# Altium project Board1.PrjPcb
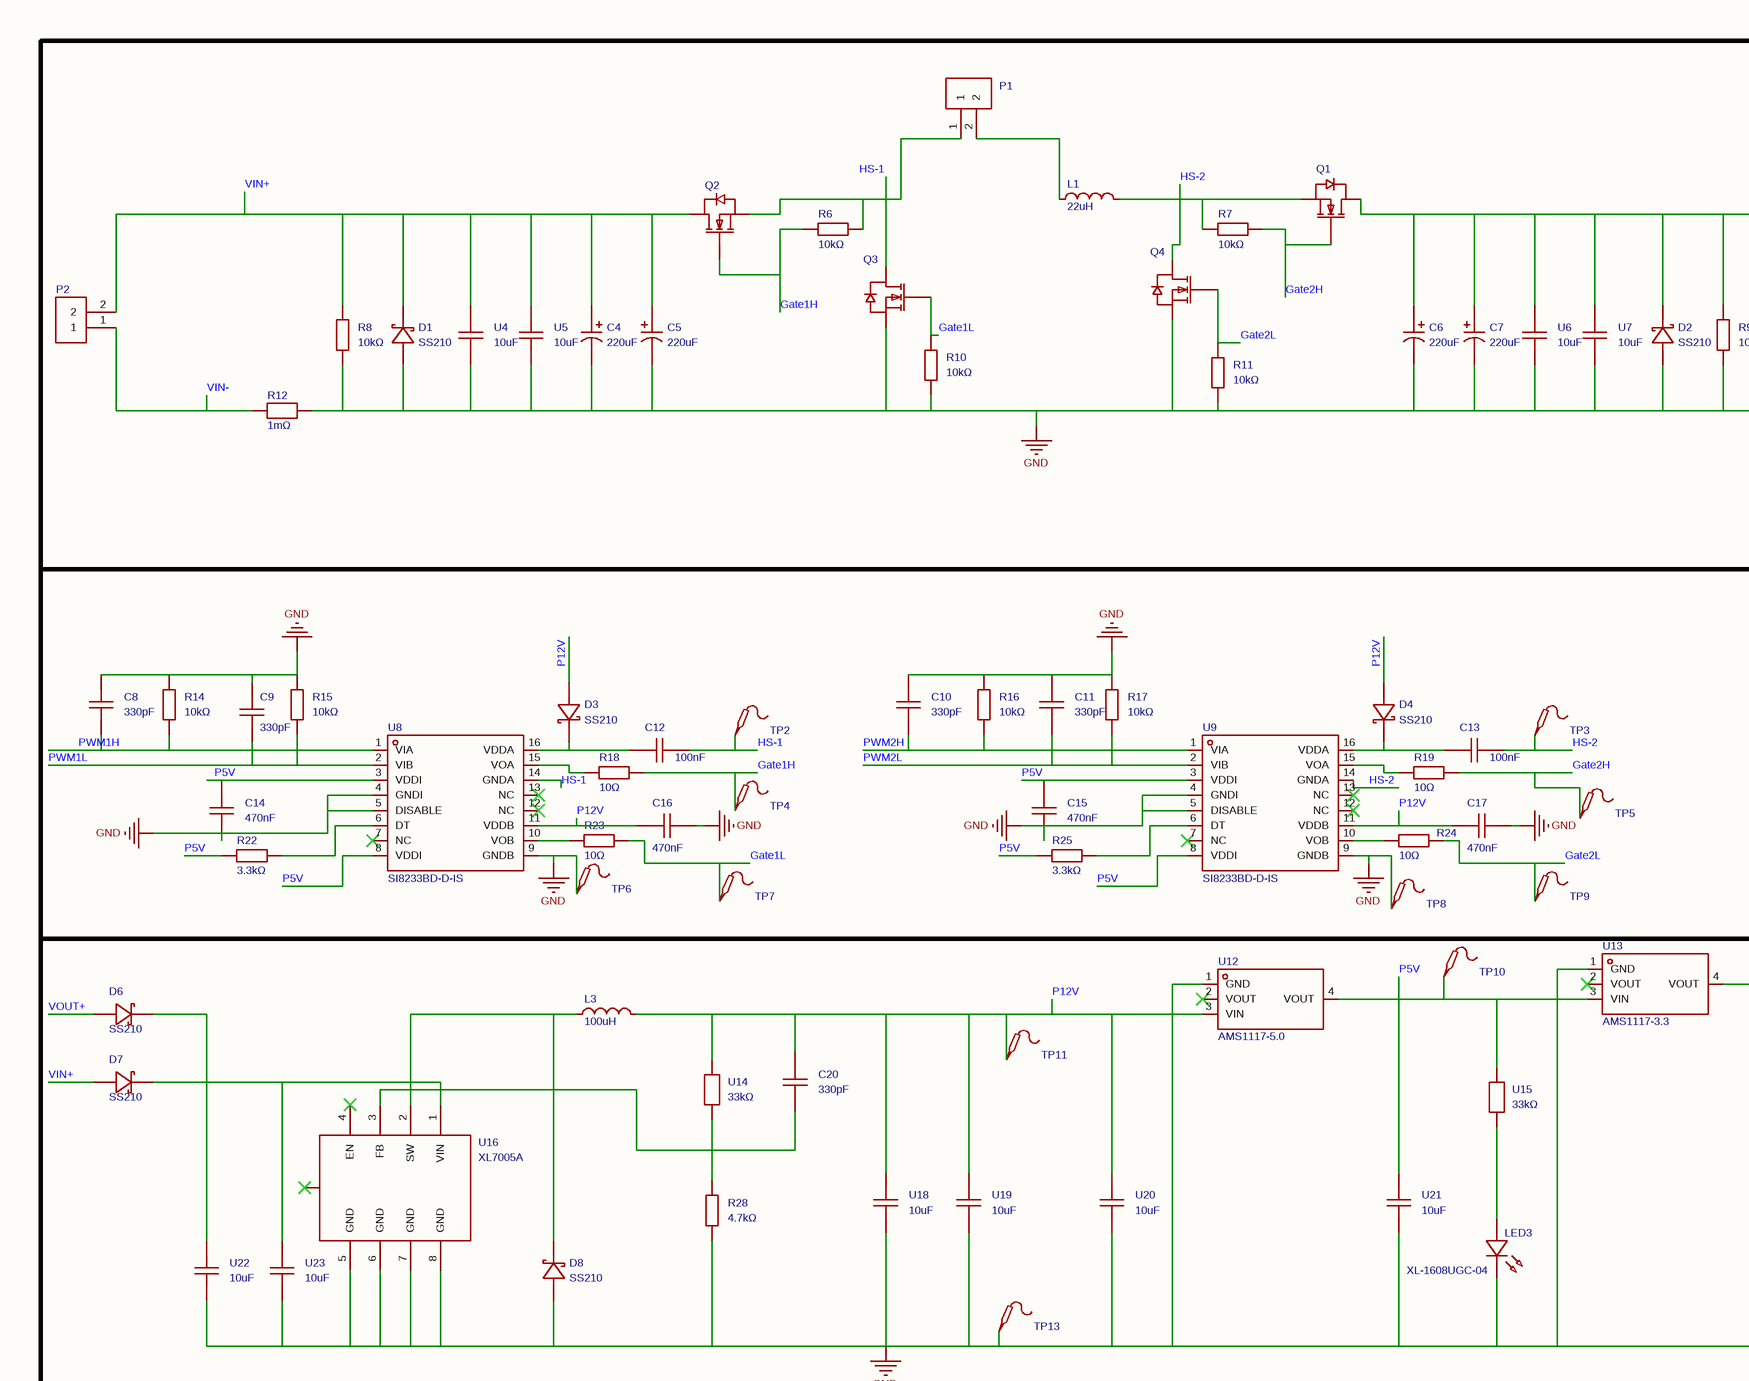
[diagram p0: P1.schdoc, top left]
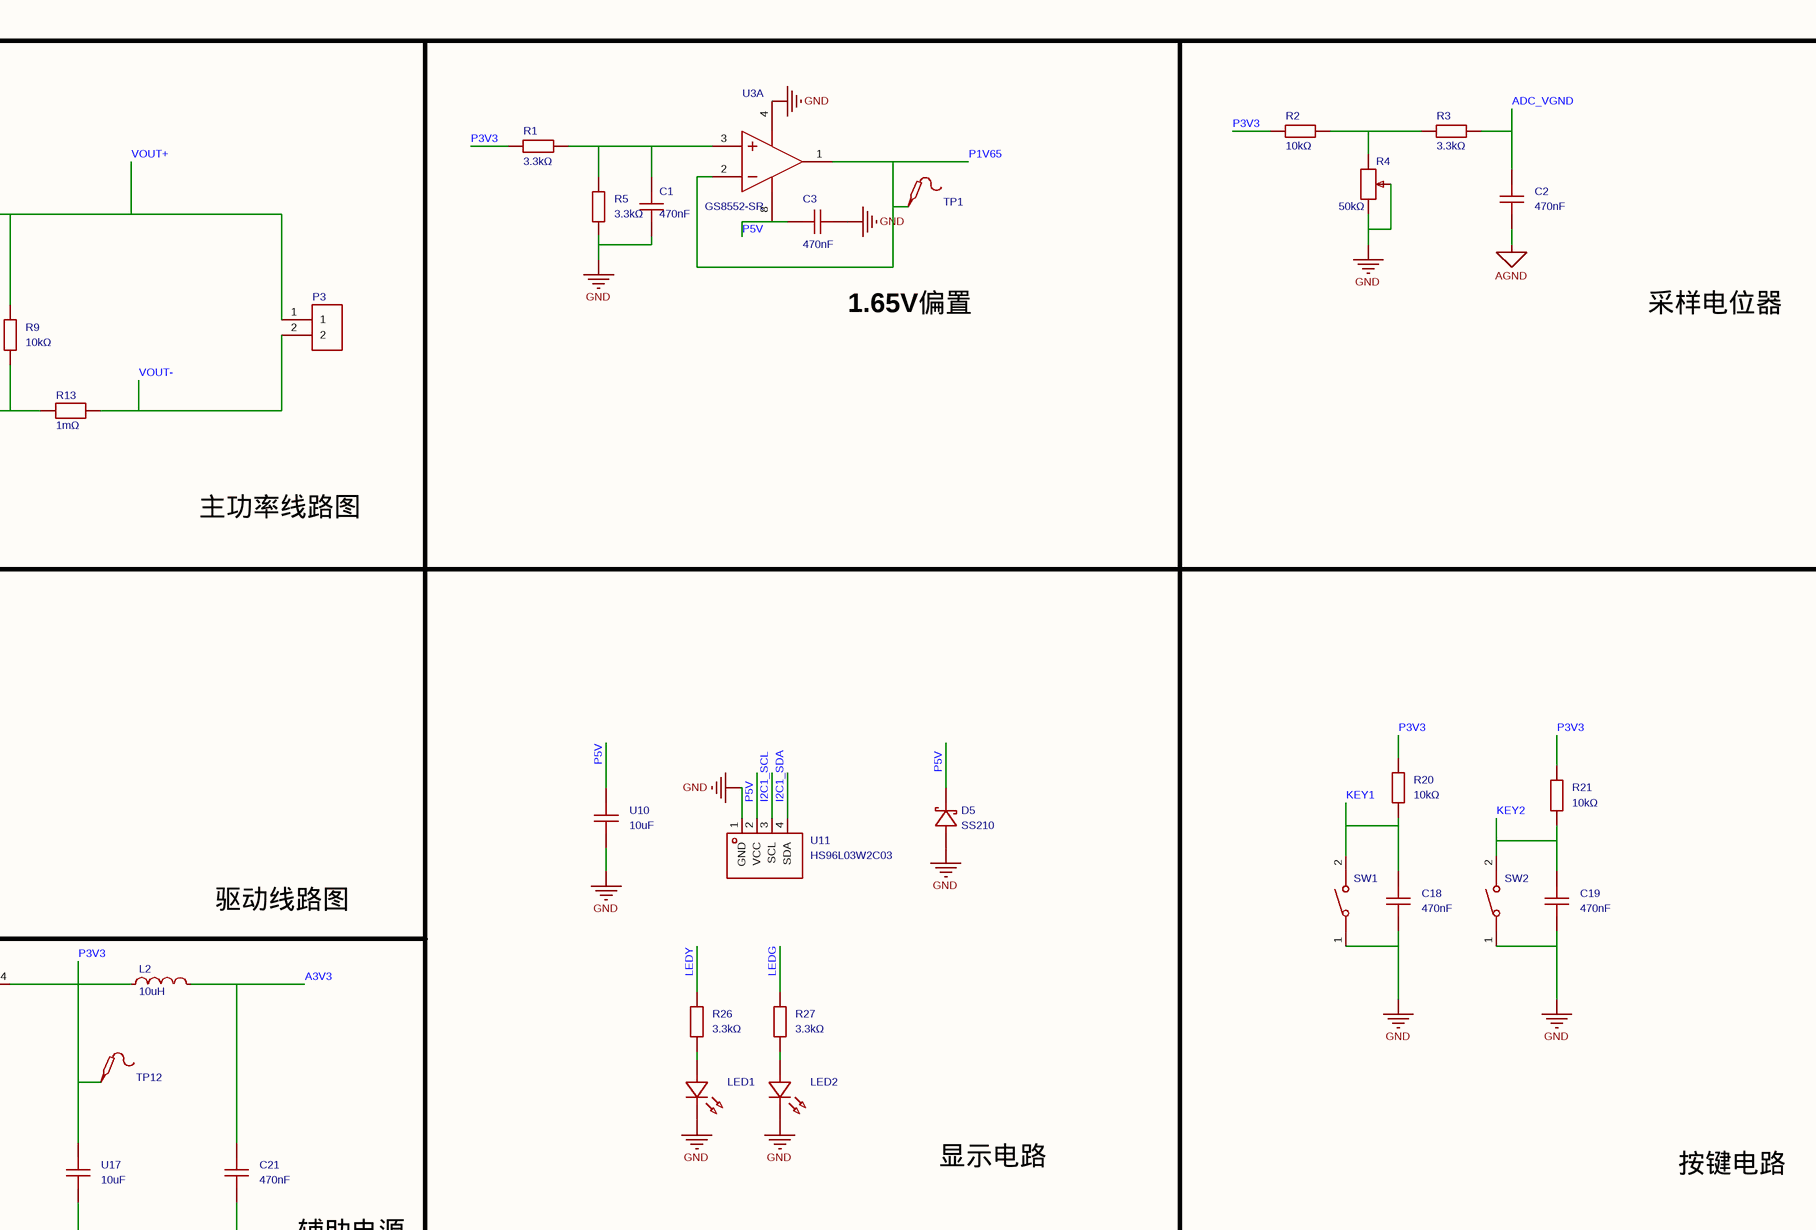
[diagram p1: P1.schdoc, top right]
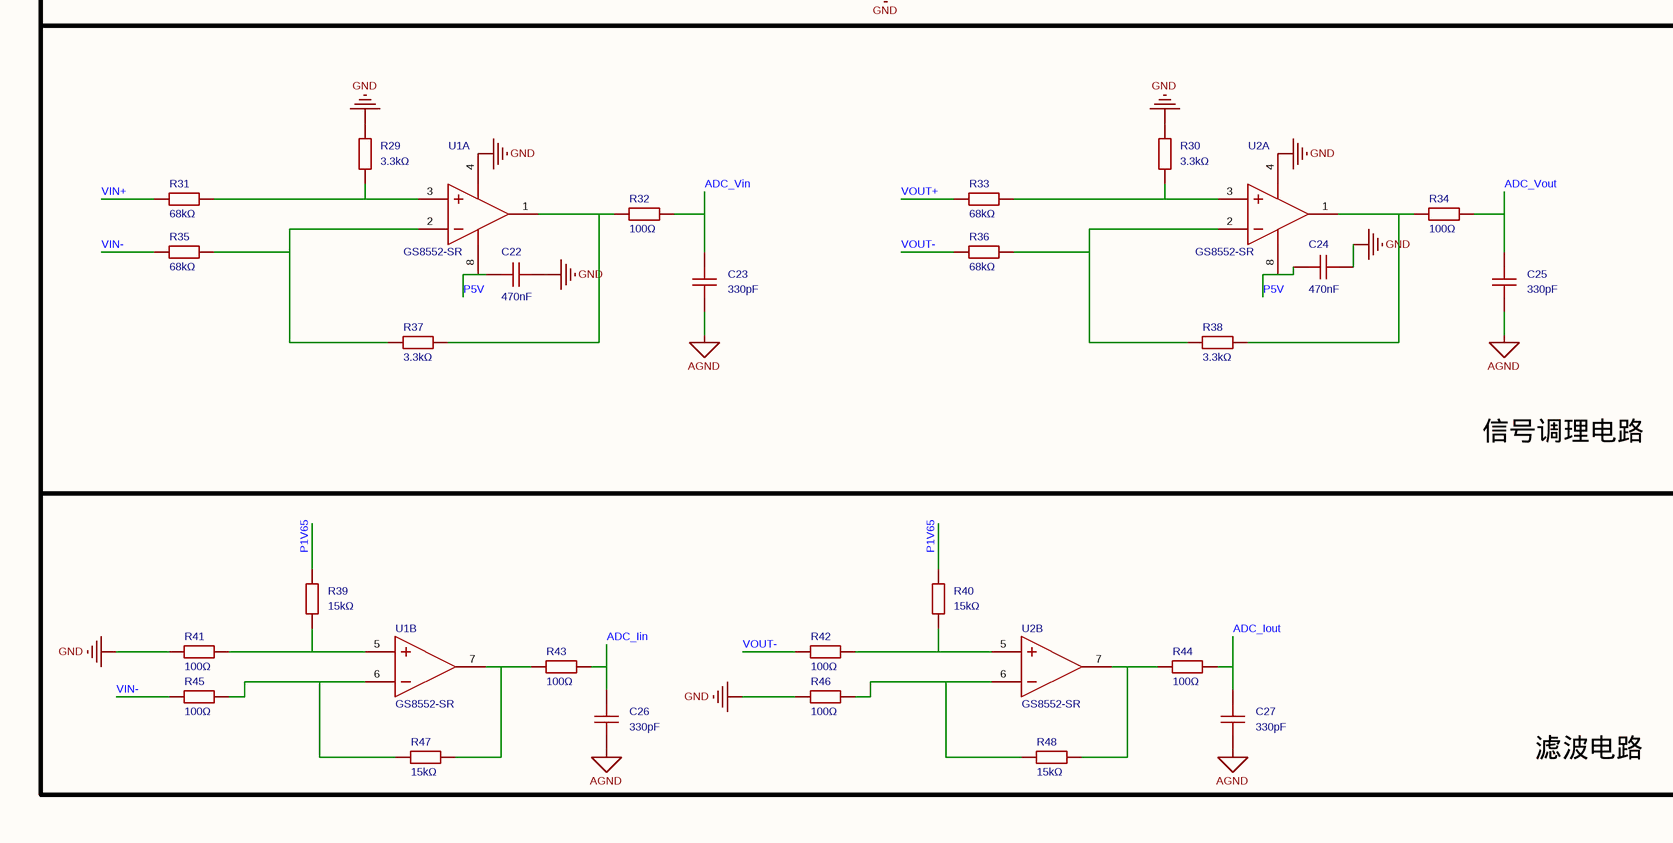
[diagram p2: P1.schdoc, bottom left]
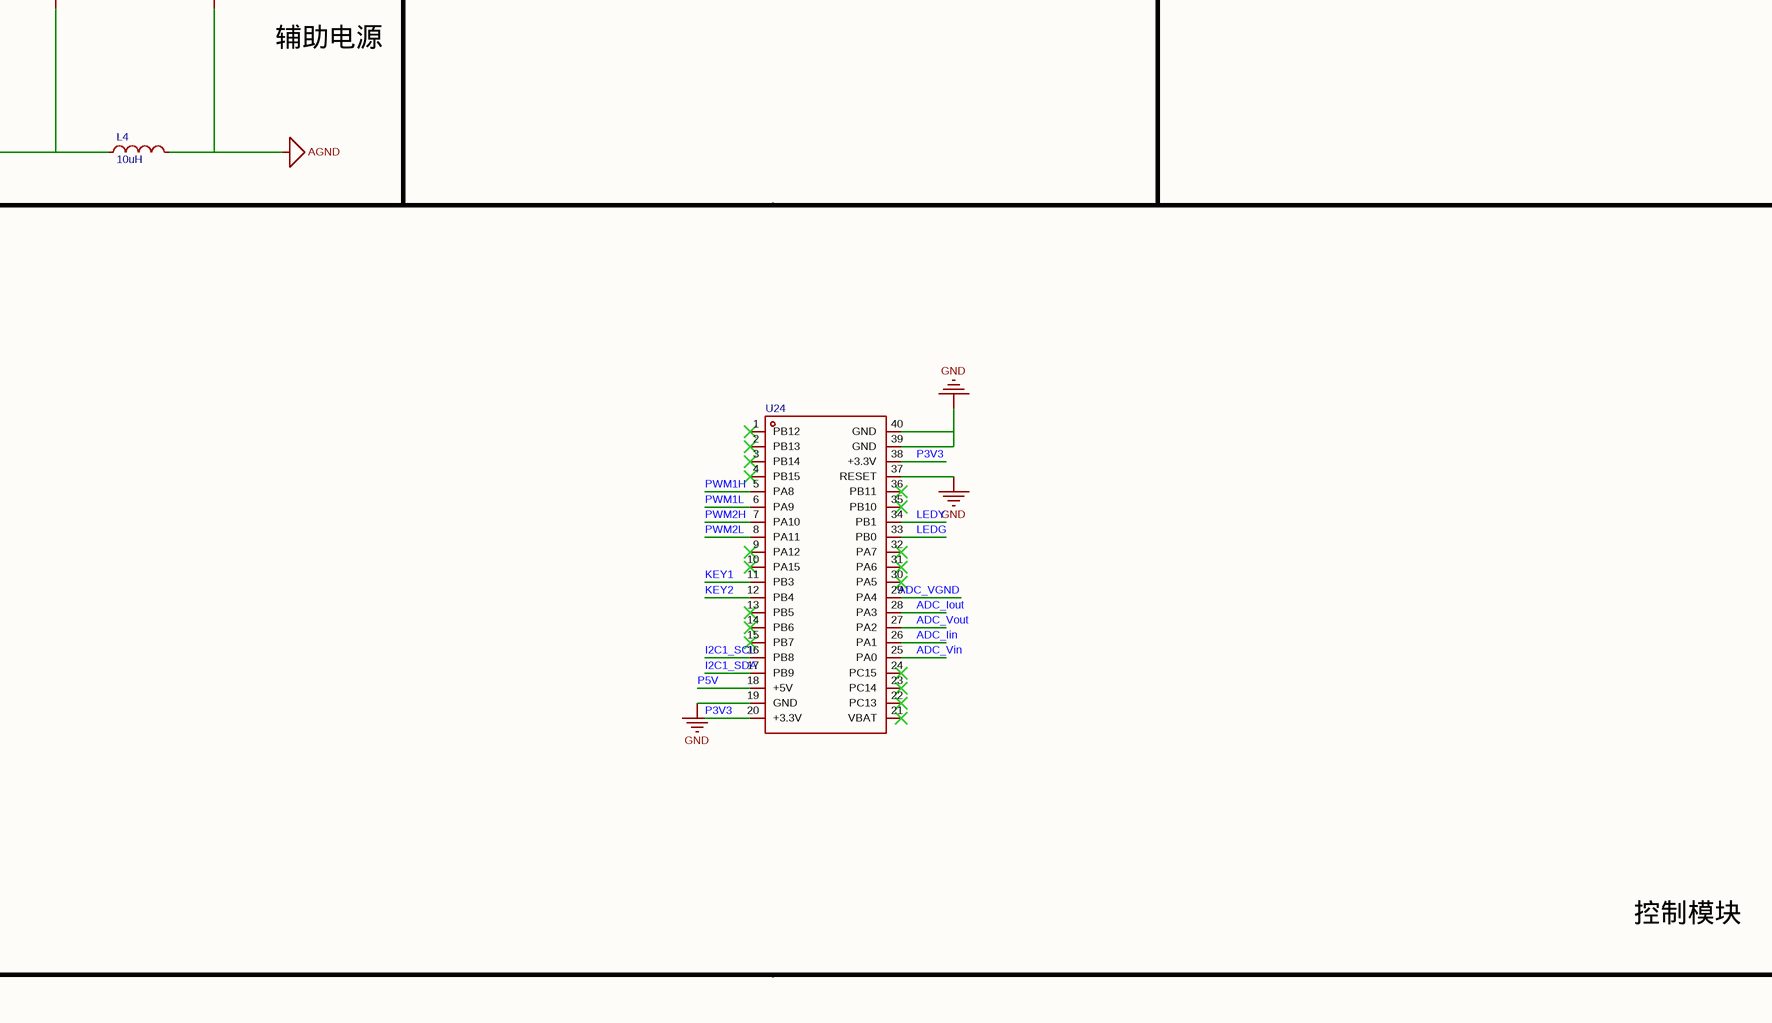
[diagram p3: P1.schdoc, bottom right]
1 sheet, 136 parts. Net scope: global (net labels, ports and power ports of the same name join across sheets).
Board file: PCB1.pcbdoc

## Sheet P1.schdoc
size 594 x 419 mm; Symbol: Sheet-Symbol_A4; Company: 嘉立创EDA; Version: V1.0; Page Size: A4; @Project Name: fin; @Page Count: 1; @Update Date: 2026-05-17; @Create Date: 2026-05-17; @Schematic Name: Schematic1; @Page No: 1; @Page Name: P1; Device: Sheet-Symbol_A4; Border: 1; Title Block Position: 3; Width: 2338; Height: 1652; Region Start: 1; X Region Count: 6; Y Region Count: 4; Blade Width: 10; @Board Name: Board1; @Create Time: 12:38:21; @Update Time: 12:38:21

### Parts
C1  470nF  [CAP-TH_L6.0-W5.0-P5.08-D0.5]
C2  470nF  [CAP-TH_L6.0-W5.0-P5.08-D0.5]
C3  470nF  [CAP-TH_L6.0-W5.0-P5.08-D0.5]
C4  220uF  [CAP-SMD_BD10.0-L10.3-W10.3-FD-LS11.0]
C5  220uF  [CAP-SMD_BD10.0-L10.3-W10.3-FD-LS11.0]
C6  220uF  [CAP-SMD_BD10.0-L10.3-W10.3-FD-LS11.0]
C7  220uF  [CAP-SMD_BD10.0-L10.3-W10.3-FD-LS11.0]
C8  330pF  [CAP-TH_L4.9-W3.7-P5.08-D0.5]
C9  330pF  [CAP-TH_L4.9-W3.7-P5.08-D0.5]
C10  330pF  [CAP-TH_L4.9-W3.7-P5.08-D0.5]
C11  330pF  [CAP-TH_L4.9-W3.7-P5.08-D0.5]
C12  100nF  [CAP-TH_L5.8-W3.6-P5.0-D0.6]
C13  100nF  [CAP-TH_L5.8-W3.6-P5.0-D0.6]
C14  470nF  [CAP-TH_L6.0-W5.0-P5.08-D0.5]
C15  470nF  [CAP-TH_L6.0-W5.0-P5.08-D0.5]
C16  470nF  [CAP-TH_L6.0-W5.0-P5.08-D0.5]
C17  470nF  [CAP-TH_L6.0-W5.0-P5.08-D0.5]
C18  470nF  [CAP-TH_L6.0-W5.0-P5.08-D0.5]
C19  470nF  [CAP-TH_L6.0-W5.0-P5.08-D0.5]
C20  330pF  [CAP-TH_L4.9-W3.7-P5.08-D0.5]
C21  470nF  [CAP-TH_L6.0-W5.0-P5.08-D0.5]
C22  470nF  [CAP-TH_L6.0-W5.0-P5.08-D0.5]
C23  330pF  [CAP-TH_L4.9-W3.7-P5.08-D0.5]
C24  470nF  [CAP-TH_L6.0-W5.0-P5.08-D0.5]
C25  330pF  [CAP-TH_L4.9-W3.7-P5.08-D0.5]
C26  330pF  [CAP-TH_L4.9-W3.7-P5.08-D0.5]
C27  330pF  [CAP-TH_L4.9-W3.7-P5.08-D0.5]
D1  SS210  [SMA_L4.3-W2.6-LS5.0-RD]
D2  SS210  [SMA_L4.3-W2.6-LS5.0-RD]
D3  SS210  [SMA_L4.3-W2.6-LS5.0-RD]
D4  SS210  [SMA_L4.3-W2.6-LS5.0-RD]
D5  SS210  [SMA_L4.3-W2.6-LS5.0-RD]
D6  SS210  [SMA_L4.3-W2.6-LS5.0-RD]
D7  SS210  [SMA_L4.3-W2.6-LS5.0-RD]
D8  SS210  [SMA_L4.3-W2.6-LS5.0-RD]
L1  22uH  [IND-SMD_2P-L16.9-W16.9]
L2  10uH  [L0603]
L3  100uH  [IND-SMD_L6.0-W6.0_CR6020]
L4  10uH  [L0603]
LED1  XL-1608UYC-06  [LED0603-RD-YELLOW]  (value not drawn)
LED2  XL-1608UGC-04  [LED0603-RD_GREEN]  (value not drawn)
LED3  XL-1608UGC-04  [LED0603-RD_GREEN]
P1  WJ500V-5.08-2P  [CONN-TH_2P-P5.00_WJ500V-5.08-2P]  (value not drawn)
P2  WJ500V-5.08-2P  [CONN-TH_2P-P5.00_WJ500V-5.08-2P]  (value not drawn)
P3  WJ500V-5.08-2P  [CONN-TH_2P-P5.00_WJ500V-5.08-2P]  (value not drawn)
Q1  IRFP4468PBF  [TO-247AC-3_L15.8-W5.0-P5.46-L]  (value not drawn)
Q2  IRFP4468PBF  [TO-247AC-3_L15.8-W5.0-P5.46-L]  (value not drawn)
Q3  IRFP4468PBF  [TO-247AC-3_L15.8-W5.0-P5.46-L]  (value not drawn)
Q4  IRFP4468PBF  [TO-247AC-3_L15.8-W5.0-P5.46-L]  (value not drawn)
R1  3.3kΩ  [RES-TH_BD2.2-L6.5-P10.50-D0.6]
R2  10kΩ  [RES-TH_BD4.5-L11.5-P15.50-D0.7]
R3  3.3kΩ  [RES-TH_BD2.2-L6.5-P10.50-D0.6]
R4  50kΩ  [RES-ADJ-TH_3296W]
R5  3.3kΩ  [RES-TH_BD2.2-L6.5-P10.50-D0.6]
R6  10kΩ  [RES-TH_BD4.5-L11.5-P15.50-D0.7]
R7  10kΩ  [RES-TH_BD4.5-L11.5-P15.50-D0.7]
R8  10kΩ  [RES-TH_BD4.5-L11.5-P15.50-D0.7]
R9  10kΩ  [RES-TH_BD4.5-L11.5-P15.50-D0.7]
R10  10kΩ  [RES-TH_BD4.5-L11.5-P15.50-D0.7]
R11  10kΩ  [RES-TH_BD4.5-L11.5-P15.50-D0.7]
R12  1mΩ  [R2512]
R13  1mΩ  [R2512]
R14  10kΩ  [RES-TH_BD4.5-L11.5-P15.50-D0.7]
R15  10kΩ  [RES-TH_BD4.5-L11.5-P15.50-D0.7]
R16  10kΩ  [RES-TH_BD4.5-L11.5-P15.50-D0.7]
R17  10kΩ  [RES-TH_BD4.5-L11.5-P15.50-D0.7]
R18  10Ω  [RES-TH_BD4.5-L11.5-P15.50-D0.7]
R19  10Ω  [RES-TH_BD4.5-L11.5-P15.50-D0.7]
R20  10kΩ  [RES-TH_BD4.5-L11.5-P15.50-D0.7]
R21  10kΩ  [RES-TH_BD4.5-L11.5-P15.50-D0.7]
R22  3.3kΩ  [RES-TH_BD2.2-L6.5-P10.50-D0.6]
R23  10Ω  [RES-TH_BD4.5-L11.5-P15.50-D0.7]
R24  10Ω  [RES-TH_BD4.5-L11.5-P15.50-D0.7]
R25  3.3kΩ  [RES-TH_BD2.2-L6.5-P10.50-D0.6]
R26  3.3kΩ  [RES-TH_BD2.2-L6.5-P10.50-D0.6]
R27  3.3kΩ  [RES-TH_BD2.2-L6.5-P10.50-D0.6]
R28  4.7kΩ  [RES-TH_BD2.3-L6.5-P10.50-D0.5]
R29  3.3kΩ  [RES-TH_BD2.2-L6.5-P10.50-D0.6]
R30  3.3kΩ  [RES-TH_BD2.2-L6.5-P10.50-D0.6]
R31  68kΩ  [RES-TH_BD4.5-L11.5-P15.50-D0.7]
R32  100Ω  [RES-TH_BD5.0-L15.5-P19.50-D0.70]
R33  68kΩ  [RES-TH_BD4.5-L11.5-P15.50-D0.7]
R34  100Ω  [RES-TH_BD5.0-L15.5-P19.50-D0.70]
R35  68kΩ  [RES-TH_BD4.5-L11.5-P15.50-D0.7]
R36  68kΩ  [RES-TH_BD4.5-L11.5-P15.50-D0.7]
R37  3.3kΩ  [RES-TH_BD2.2-L6.5-P10.50-D0.6]
R38  3.3kΩ  [RES-TH_BD2.2-L6.5-P10.50-D0.6]
R39  15kΩ  [RES-TH_BD2.2-L6.5-P10.50-D0.6]
R40  15kΩ  [RES-TH_BD2.2-L6.5-P10.50-D0.6]
R41  100Ω  [RES-TH_BD5.0-L15.5-P19.50-D0.70]
R42  100Ω  [RES-TH_BD5.0-L15.5-P19.50-D0.70]
R43  100Ω  [RES-TH_BD5.0-L15.5-P19.50-D0.70]
R44  100Ω  [RES-TH_BD5.0-L15.5-P19.50-D0.70]
R45  100Ω  [RES-TH_BD5.0-L15.5-P19.50-D0.70]
R46  100Ω  [RES-TH_BD5.0-L15.5-P19.50-D0.70]
R47  15kΩ  [RES-TH_BD2.2-L6.5-P10.50-D0.6]
R48  15kΩ  [RES-TH_BD2.2-L6.5-P10.50-D0.6]
SW1  TS-1088-AR02016  [SW-SMD_L3.9-W3.0-P4.45]  (value not drawn)
SW2  TS-1088-AR02016  [SW-SMD_L3.9-W3.0-P4.45]  (value not drawn)
TP1  (no value)  [Test-Point-0.5mm]
TP2  (no value)  [Test-Point-0.5mm]
TP3  (no value)  [Test-Point-0.5mm]
TP4  (no value)  [Test-Point-0.5mm]
TP5  (no value)  [Test-Point-0.5mm]
TP6  (no value)  [Test-Point-0.5mm]
TP7  (no value)  [Test-Point-0.5mm]
TP8  (no value)  [Test-Point-0.5mm]
TP9  (no value)  [Test-Point-0.5mm]
TP10  (no value)  [Test-Point-0.5mm]
TP11  (no value)  [Test-Point-0.5mm]
TP12  (no value)  [Test-Point-0.5mm]
TP13  (no value)  [Test-Point-0.5mm]
U1  GS8552-SR  [SOIC-8_L4.9-W3.9-P1.27-LS6.0-BL]  (parts A,B of 2)
U2  GS8552-SR  [SOIC-8_L4.9-W3.9-P1.27-LS6.0-BL]  (parts A,B of 2)
U3  GS8552-SR  [SOIC-8_L4.9-W3.9-P1.27-LS6.0-BL]  (part A of 2)
U4  10uF  [CAP-TH_L5.5-W3.8-P5.08-D0.5]
U5  10uF  [CAP-TH_L5.5-W3.8-P5.08-D0.5]
U6  10uF  [CAP-TH_L5.5-W3.8-P5.08-D0.5]
U7  10uF  [CAP-TH_L5.5-W3.8-P5.08-D0.5]
U8  SI8233BD-D-IS  [SOIC-16_L10.3-W7.5-P1.27-LS10.3-BL]
U9  SI8233BD-D-IS  [SOIC-16_L10.3-W7.5-P1.27-LS10.3-BL]
U10  10uF  [CAP-TH_L5.5-W3.8-P5.08-D0.5]
U11  HS96L03W2C03  [OLED-TH_L27.8-W27.2-P2.54_C9900033791]
U12  AMS1117-5.0  [SOT-223_L6.5-W3.5-P2.30-LS7.0-BR]
U13  AMS1117-3.3  [SOT-223-3_L6.5-W3.4-P2.30-LS7.0-BR]
U14  33kΩ  [RES-TH_BD2.4-L6.3-P10.30-D0.6]
U15  33kΩ  [RES-TH_BD2.4-L6.3-P10.30-D0.6]
U16  XL7005A  [SOIC-8_L4.9-W3.9-P1.27-LS6.0-BL-EP3.1-1]
U17  10uF  [CAP-TH_L5.5-W3.8-P5.08-D0.5]
U18  10uF  [CAP-TH_L5.5-W3.8-P5.08-D0.5]
U19  10uF  [CAP-TH_L5.5-W3.8-P5.08-D0.5]
U20  10uF  [CAP-TH_L5.5-W3.8-P5.08-D0.5]
U21  10uF  [CAP-TH_L5.5-W3.8-P5.08-D0.5]
U22  10uF  [CAP-TH_L5.5-W3.8-P5.08-D0.5]
U23  10uF  [CAP-TH_L5.5-W3.8-P5.08-D0.5]
U24  LCKFB-DKX-STM32F103C8T6  [CONN-TH_L53.3-W22.9_STM32F103C8T6-CARD]  (value not drawn)

### Blocks framed on the sheet
主功率线路图: C4-C7 D1 D2 L1 P1-P3 Q1-Q4 R6-R13 U4-U7
驱动线路图: C8-C17 D3 D4 R14-R19 R22-R25 TP2-TP9 U8 U9
信号调理电路: C22-C25 R29-R38 U1 U2

### Nets
AGND: C2.1 C21.1 C23.1 C25.1 C26.1 C27.1 L4.2
GND: C1.1 C3.1 C4.2 C5.2 C6.2 C7.2 C8.2 C9.2 C10.2 C11.2 C14.1 C15.1 C16.1 C17.1 C18.1 C19.1 C22.1 C24.1 D1.2(A) D2.2(A) D5.2(A) D8.2(A) L4.1 LED1.1(K) LED2.1(K) LED3.1(K) Q3.3(S) Q4.3(S) R4.2 R4.3 R5.1 R8.1 R9.1 R10.2 R11.2 R12.2 R13.2 R14.2 R15.2 R16.2 R17.2 R28.1 R29.2 R30.2 R41.1 R46.1 SW1.1 SW2.1 TP6.1 TP8.1 TP13.1 U1.4(-V) U2.4(-V) U3.4(-V) U4.1 U5.1 U6.1 U7.1 U8.4(GNDI) U8.5(DISABLE) U8.9(GNDB) U9.4(GNDI) U9.5(DISABLE) U9.9(GNDB) U10.1 U11.1(GND) U12.1(GND) U13.1(GND) U16.5(GND) U16.6(GND) U16.7(GND) U16.8(GND) U17.1 U18.1 U19.1 U20.1 U21.1 U22.1 U23.1 U24.19(GND) U24.37(RESET) U24.39(GND) U24.40(GND)
A3V3: C21.2 L2.2
ADC_Iin: C26.2 R43.2 U24.26(PA1)
ADC_Iout: C27.2 R44.2 U24.28(PA3)
ADC_VGND: C2.2 R3.2 U24.29(PA4)
ADC_Vin: C23.2 R32.2 U24.25(PA0)
ADC_Vout: C25.2 R34.2 U24.27(PA2)
Gate1H: Q2.1(G) R6.2 R18.2 TP4.1
Gate1L: Q3.1(G) R10.1 R23.2 TP7.1
Gate2H: Q1.1(G) R7.1 R19.2 TP5.1
Gate2L: Q4.1(G) R11.1 R24.2 TP9.1
HS-1: C12.2 P1.1 Q2.3(S) Q3.2(D) R6.1 TP2.1 U8.14(GNDA)
HS-2: C13.2 L1.2 Q1.3(S) Q4.2(D) R7.2 TP3.1 U9.14(GNDA)
I2C1_SCL: U11.3(SCL) U24.16(PB8)
I2C1_SDA: U11.4(SDA) U24.17(PB9)
KEY1: C18.2 R20.1 SW1.2 U24.11(PB3)
KEY2: C19.2 R21.1 SW2.2 U24.12(PB4)
LEDG: R27.2 U24.33(PB0)
LEDY: R26.2 U24.34(PB1)
P1V65: R39.2 R40.2 TP1.1 U3.1(OUT) U3.2(INVERTING_INPUT)
P3V3: L2.1 R1.1 R2.2 R20.2 R21.2 TP12.1 U13.4(VOUT) U17.2 U24.20(+3.3V) U24.38(+3.3V)
P5V: C3.2 C14.2 C15.2 C22.2 C24.2 D5.1(K) R22.1 R25.1 TP10.1 U1.8(+V) U2.8(+V) U3.8(+V) U8.3(VDDI) U8.8(VDDI) U9.3(VDDI) U9.8(VDDI) U10.2 U11.2(VCC) U12.4(VOUT) U13.3(VIN) U15.2 U21.2 U24.18(+5V)
P12V: C16.2 C17.2 C20.2 D3.2(A) D4.2(A) L3.2 TP11.1 U8.11(VDDB) U9.11(VDDB) U12.3(VIN) U14.2 U18.2 U19.2 U20.2
PWM1H: C8.1 R14.1 U8.1(VIA) U24.5(PA8)
PWM1L: C9.1 R15.1 U8.2(VIB) U24.6(PA9)
PWM2H: C10.1 R16.1 U9.1(VIA) U24.7(PA10)
PWM2L: C11.1 R17.1 U9.2(VIB) U24.8(PA11)
VIN+: C4.1 C5.1 D1.1(K) D7.2(A) P2.2 Q2.2(D) R8.2 R31.1 U4.2 U5.2
VIN-: P2.1 R12.1 R35.1 R45.1
VOUT+: C6.1 C7.1 D2.1(K) D6.2(A) P3.1 Q1.2(D) R9.2 R33.1 U6.2 U7.2
VOUT-: P3.2 R13.1 R36.1 R42.1
NetC1_2: C1.2 R1.2 R5.2 U3.3(NONINVERTING_INPUT)
NetC12_1: C12.1 D3.1(K) U8.16(VDDA)
NetC13_1: C13.1 D4.1(K) U9.16(VDDA)
NetC20_1: C20.1 R28.2 U14.1 U16.3(FB)
NetD6_1: D6.1(K) D7.1(K) U16.1(VIN) U22.2 U23.2
NetD8_1: D8.1(K) L3.1 U16.2(SW)
NetL1_1: L1.1 P1.2
NetLED1_2: LED1.2(A) R26.1
NetLED2_2: LED2.2(A) R27.1
NetLED3_2: LED3.2(A) U15.1
NetR2_1: R2.1 R3.1 R4.1
NetR18_1: R18.1 U8.15(VOA)
NetR19_1: R19.1 U9.15(VOA)
NetR22_2: R22.2 U8.6(DT)
NetR23_1: R23.1 U8.10(VOB)
NetR24_1: R24.1 U9.10(VOB)
NetR25_2: R25.2 U9.6(DT)
NetR29_1: R29.1 R31.2 U1.3(NONINVERTING_INPUT)
NetR30_1: R30.1 R33.2 U2.3(NONINVERTING_INPUT)
NetR32_1: R32.1 R37.2 U1.1(OUT)
NetR34_1: R34.1 R38.2 U2.1(OUT)
NetR35_2: R35.2 R37.1 U1.2(INVERTING_INPUT)
NetR36_2: R36.2 R38.1 U2.2(INVERTING_INPUT)
NetR39_1: R39.1 R41.2 U1.5(NONINVERTING_INPUT)
NetR40_1: R40.1 R42.2 U2.5(NONINVERTING_INPUT)
NetR43_1: R43.1 R47.2 U1.7(OUT)
NetR44_1: R44.1 R48.2 U2.7(OUT)
NetR45_2: R45.2 R47.1 U1.6(INVERTING_INPUT)
NetR46_2: R46.2 R48.1 U2.6(INVERTING_INPUT)

Not connected (* = marked no-connect by the designer): U8 7(NC)* 12(NC)* 13(NC)*; U9 7(NC)* 12(NC)* 13(NC)*; U12 2(VOUT)*; U13 2(VOUT)*; U16 4(EN)* 9*; U24 1(PB12)* 2(PB13)* 3(PB14)* 4(PB15)* 9(PA12)* 10(PA15)* 13(PB5)* 14(PB6)* 15(PB7)* 21(VBAT)* 22(PC13)* 23(PC14)* 24(PC15)* 30(PA5)* 31(PA6)* 32(PA7)* 35(PB10)* 36(PB11)*

### Notes on the sheet
- 1.65V偏置
- 采样电位器
- 显示电路
- 按键电路
- 辅助电源
- 滤波电路
- 控制模块
- 更新日期
- 2026-05-17
- 原理图
- 图页
- Schematic1
- P1
- 创建日期
- 物料编码
- 审阅
- 绘制
- fin
- 版本
- V1.0
- 尺寸
- A4
- 页
- 1
- 嘉立创EDA
- 共
- Board1

### Library data of the parts
C1-C3 C14-C19 C21 C22 C24 = CT4-1206B474K101F3-Y: 容值:470nF;精度:±10%;额定电压:100V;; Manufacturer: KYET(科雅); AddInBom: yes; ModelId: 5366a4b42989498ea42b999c17b4cd530819f05c4eef4c71ace90d822a990e87; ModelTransform: 236.22,197.2437,0,0,0,0,0,0,-196.85; Tolerance: ±10%; Voltage Rating: 100V; Pin Spacing: 5.08mm; Symbol: CT4-1206B474K101F3-Y; Device: CT4-1206B474K101F3-Y; LCSC Part Name: 470nF ±10% 100V; SupplierPart: C49215583; ManufacturerPart: CT4-1206B474K101F3-Y; Supplier Footprint: 插件,P=5.08mm; JLCPCB Part Class: Extended Part; Datasheet: https://item.szlcsc.com/datasheet/CT4-1206B474K101F3-Y/51625502.html; Supplier: LCSC; ConvertToPcb: yes; FootprintName: CAP-TH_L6.0-W5.0-P5.08-D0.5; ModelName: CAP-TH_L6.0-W5.0-P5.08-D0.5; Value: 470nF
C4-C7 = JVJ63V220M10x10: 容值:220uF;精度:±20%;额定电压:63V;纹波电流:225mA@120Hz;; Manufacturer: JIERR(捷而瑞); AddInBom: yes; ModelId: c5805980ffa24e6da624be5898d1d67f0819f05c4eef4c71ace90d822a990e87; ModelTransform: 433.07,405.511,0,180,0,0,0,0,0; Tolerance: ±20%; Voltage Rating: 63V; Lifetime: 2000hrs@105℃; Symbol: JVJ63V220M10X10; Device: JVJ63V220M10x10; LCSC Part Name: 220uF ±20% 63V; SupplierPart: C46550422; ManufacturerPart: JVJ63V220M10x10; Supplier Footprint: SMD,D10xL10.5mm; JLCPCB Part Class: Extended Part; Datasheet: https://item.szlcsc.com/datasheet/JVJ63V220M10x10/48680116.html; Supplier: LCSC; ConvertToPcb: yes; FootprintName: CAP-SMD_BD10.0-L10.3-W10.3-FD-LS11.0; ModelName: CAP-SMD_BD10.0-L10.3-W10.3-FD-LS11.0; Value: 220uF; Ripple Current: 225mA@120Hz; Diameter: 10mm; Height - Seated (Max): 10.5mm; Operating Temperature: -55℃~+105℃
C8-C11 C20 C23 C25-C27 = CL0805CG100V331JS: 容值:330pF;精度:±5%;额定电压:100V;温度系数:COG;; Manufacturer: TORCH(火炬); AddInBom: yes; ModelId: d480a48107b54a3595d34e62c8baa7590819f05c4eef4c71ace90d822a990e87; ModelName: CAP-TH_L4.9-W3.7-H2.5-P5.08; ModelTransform: 215.7476,125.984,0,0,0,0,0,0,-137.795; Tolerance: ±5%; Voltage Rating: 100V; Temperature Coefficient: COG; Pin Spacing: 5.08mm; Symbol: CL0805CG100V331JS; Device: CL0805CG100V331JS; LCSC Part Name: 330pF ±5% 100V; SupplierPart: C53084600; ManufacturerPart: CL0805CG100V331JS; Supplier Footprint: 插件,P=5.08mm; JLCPCB Part Class: Extended Part; Datasheet: https://item.szlcsc.com/datasheet/CL0805CG100V331JS/56049065.html; Supplier: LCSC; ConvertToPcb: yes; FootprintName: CAP-TH_L4.9-W3.7-P5.08-D0.5; Value: 330pF
C12 C13 = 178MU0002: 容值:100nF;精度:±10%;额定电压:50V;温度系数:X7R;; Manufacturer: KNSCHA(科尼盛); AddInBom: yes; ModelId: 67fba78a874e4dacbebdaf42387313520819f05c4eef4c71ace90d822a990e87; ModelTransform: 228.346,142.1257,0,0,0,0,0,0,-196.85; Tolerance: ±10%; Voltage Rating: 50V; Temperature Coefficient: X7R; Pin Spacing: 5.08mm; Symbol: 178MU0002; Device: 178MU0002; LCSC Part Name: 100nF ±10% 50V; SupplierPart: C5632426; ManufacturerPart: 178MU0002; Supplier Footprint: 插件,P=5.08mm; JLCPCB Part Class: Extended Part; Datasheet: https://item.szlcsc.com/datasheet/178MU0002/6552581.html; Supplier: LCSC; ConvertToPcb: yes; FootprintName: CAP-TH_L5.8-W3.6-P5.0-D0.6; ModelName: CAP-TH_L5.8-W3.6-P5.0-D0.6; Value: 100nF
D1-D4 D6-D8 = SS210_C18199175: 二极管配置:独立式;正向压降(Vf):850mV@2A;直流反向耐压(Vr):100V;整流电流:2A;; Manufacturer: R+O(宏嘉诚); AddInBom: yes; ModelId: 8d2dd2e50a3a4b27821fa63d469a8f110819f05c4eef4c71ace90d822a990e87; ModelTransform: 196.85,102.362,0,0,0,0,0,0,0; Diode Configuration: 独立式; Voltage - DC Reverse(Vr): 100V; Current - Rectified: 2A; Reverse Leakage Current (Ir): 50uA@100V; Operating Junction Temperature Range: -55℃~+150℃; Non-Repetitive Peak Forward Surge Current: 50A; Symbol: SS210_C18199175; Device: SS210_C18199175; LCSC Part Name: 电压:100V 电流:2A; SupplierPart: C18199175; ManufacturerPart: SS210; Supplier Footprint: SMA(DO-214AC); JLCPCB Part Class: Extended Part; Datasheet: https://item.szlcsc.com/datasheet/SS210/19354407.html; Supplier: LCSC; ConvertToPcb: yes; FootprintName: SMA_L4.3-W2.6-LS5.0-RD; ModelName: SMA_L4.3-W2.6-LS5.0-RD; Voltage - Forward(Vf@If): 850mV@2A
D5 = SS210_C18199175: 二极管配置:独立式;正向压降(Vf):850mV@2A;直流反向耐压(Vr):100V;整流电流:2A;; Manufacturer: R+O(宏嘉诚); 3D Model: 8d2dd2e50a3a4b27821fa63d469a8f110819f05c4eef4c71ace90d822a990e87; 3D Model Transform: 196.85,102.362,0,0,0,0,0,0,0; Diode Configuration: 独立式; Voltage - DC Reverse(Vr): 100V; Current - Rectified: 2A; Reverse Leakage Current (Ir): 50uA@100V; Operating Junction Temperature Range: -55℃~+150℃; Non-Repetitive Peak Forward Surge Current: 50A; AddInBom: yes; Symbol: SS210_C18199175; Device: SS210_C18199175; LCSC Part Name: 电压:100V 电流:2A; Supplier Part: C18199175; Manufacturer Part: SS210; Supplier Footprint: SMA(DO-214AC); JLCPCB Part Class: Extended Part; Datasheet: https://item.szlcsc.com/datasheet/SS210/19354407.html; Supplier: LCSC; Voltage - Forward(Vf@If): 850mV@2A; ConvertToPcb: yes; FootprintName: SMA_L4.3-W2.6-LS5.0-RD; ModelName: SMA_L4.3-W2.6-LS5.0-RD
L1 = MDA1870-220M: 电感值:22uH;精度:±20%;额定电流:13.5A;饱和电流(Isat):13.5A;直流电阻(DCR):20.5mΩ;; Manufacturer: KOHERelec(科或); AddInBom: yes; ModelId: 69014a8d40644ee482cb69c22c4ffe030819f05c4eef4c71ace90d822a990e87; ModelTransform: 692.912,665.353,0,0,0,0,0,0,0; Tolerance: ±20%; Current Rating: 13.5A; DC Resistance(DCR): 20.5mΩ; Symbol: MDA1870-220M; Device: MDA1870-220M; LCSC Part Name: 22uH ±20% 13.5A; SupplierPart: C2847590; ManufacturerPart: MDA1870-220M; Supplier Footprint: SMD,17.8x16.9mm; JLCPCB Part Class: Extended Part; Datasheet: https://item.szlcsc.com/datasheet/MDA1870-220M/3044749.html; Supplier: LCSC; ConvertToPcb: yes; FootprintName: IND-SMD_2P-L16.9-W16.9; ModelName: IND-SMD_2P-L16.9-W16.9; Value: 22uH; Current - Saturation (Isat): 13.5A
L2 L4 = SDFL1608S100KTF: 电感值:10uH;精度:±10%;额定电流:3mA;饱和电流(Isat):-;直流电阻(DCR):1.85Ω;; Manufacturer: Sunlord(顺络); AddInBom: yes; ModelId: 2bc5ec593d464d6ba9807aec0b5673c20819f05c4eef4c71ace90d822a990e87; ModelName: L0603_L1.6-W0.8-H0.5_BEAD; ModelTransform: 62.992,31.496,0,180,0,0,0.094,0.629,0; Tolerance: ±10%; Current Rating: 3mA; DC Resistance(DCR): 1.85Ω; Q @ Frequency: 30@2MHz; Frequency - Self Resonant: 17MHz; Symbol: SDFL1608S100KTF; Device: SDFL1608S100KTF; LCSC Part Name: 10uH ±10%; SupplierPart: C1035; ManufacturerPart: SDFL1608S100KTF; Supplier Footprint: 0603; JLCPCB Part Class: Basic Part; Datasheet: https://item.szlcsc.com/datasheet/SDFL1608S100KTF/1387.html; Supplier: LCSC; ConvertToPcb: yes; FootprintName: L0603; Value: 10uH; Current - Saturation (Isat): -; Ratings: -
L3 = CR6020-101M: 电感值:100uH;精度:±20%;额定电流:500mA;饱和电流(Isat):550mA;; Manufacturer: ceaiya(柯爱亚); AddInBom: yes; ModelId: 6ed5412c8907432393ddf32fe89ec5c30819f05c4eef4c71ace90d822a990e87; ModelTransform: 236.22,236.22,0,0,0,0,0,0,0; Tolerance: ±20%; Current Rating: 500mA; Current - Saturation(Isat): 550mA; DC Resistance(DCR): 1.15Ω; Symbol: CR6020-101M; Device: CR6020-101M; LCSC Part Name: 100uH ±20% 550mA; SupplierPart: C7588747; ManufacturerPart: CR6020-101M; Supplier Footprint: SMD,6x6mm; JLCPCB Part Class: Extended Part; Datasheet: https://item.szlcsc.com/datasheet/CR6020-101M/8708612.html; Supplier: LCSC; ConvertToPcb: yes; FootprintName: IND-SMD_L6.0-W6.0_CR6020; ModelName: IND-SMD_L6.0-W6.0_CR6020; Value: 100uH
LED1 = XL-1608UYC-06: 灯头类型:-;发光颜色:黄色;正向压降(Vf):2.4V;功率:50mW;正向电流:20mA;波长:585nm~595nm;二极管配置:独立二极管;透镜颜色:无色透明透镜;色温:-;发光强度:435mcd;发光角度:120°;载带方式:正贴;工作温度:-40℃~+85℃;; Manufacturer: XINGLIGHT(成兴光); 3D Model: a8fc7d5425514cf49dd600af0a7bb2230819f05c4eef4c71ace90d822a990e87; 3D Model Transform: 63.7794,32.283,0,0,0,0,-1.969,0,0; Illumination Color: 黄色; Voltage - Forward(Vf): 2.4V; Power(Watts): 50mW; Forward Current: 20mA; Peak Wavelength: 590nm; Diode Configuration: 独立二极管; Lens Color: 无色透明透镜; Luminous Intensity: 435mcd; Viewing Angle: 120°; AddInBom: yes; Symbol: XL-1608UYC-06; Device: XL-1608UYC-06; LCSC Part Name: 0603黄色贴片式发光二极管; Supplier Part: C965802; Manufacturer Part: XL-1608UYC-06; Supplier Footprint: 0603; JLCPCB Part Class: Extended Part; Datasheet: https://item.szlcsc.com/datasheet/XL-1608UYC-06/1051411.html; Supplier: LCSC; Lamp Holder Type: -; Wavelength - Dominant: 585nm~595nm; Color Temperature: -; Mounting Style: 正贴; Operating Temperature: -40℃~+85℃; ConvertToPcb: yes; FootprintName: LED0603-RD-YELLOW; ModelName: LED0603-RD-YELLOW
LED2 = XL-1608UGC-04: 灯头类型:-;发光颜色:翠绿色;正向压降(Vf):3.3V;功率:70mW;正向电流:20mA;波长:515nm~535nm;二极管配置:独立二极管;透镜颜色:无色透明透镜;色温:-;发光强度:810mcd;发光角度:120°;载带方式:正贴;工作温度:-40℃~+85℃;; Manufacturer: XINGLIGHT(成兴光); 3D Model: 7761174b67d9475ab0dbce38062fb2f90819f05c4eef4c71ace90d822a990e87; 3D Model Transform: 63.7794,31.496,0,0,0,0,0,0,0; Illumination Color: 翠绿色; Voltage - Forward(Vf): 3.3V; Power(Watts): 70mW; Forward Current: 20mA; Peak Wavelength: 525nm; Diode Configuration: 独立二极管; Lens Color: 无色透明透镜; Luminous Intensity: 810mcd; Viewing Angle: 120°; AddInBom: yes; Symbol: XL-1608UGC-04; Device: XL-1608UGC-04; LCSC Part Name: 0603翠绿贴片式发光二极管; Supplier Part: C965804; Manufacturer Part: XL-1608UGC-04; Supplier Footprint: 0603; JLCPCB Part Class: Extended Part; Datasheet: https://item.szlcsc.com/datasheet/XL-1608UGC-04/1051413.html; Supplier: LCSC; Lamp Holder Type: -; Wavelength - Dominant: 515nm~535nm; Color Temperature: -; Mounting Style: 正贴; Operating Temperature: -40℃~+85℃; ConvertToPcb: yes; FootprintName: LED0603-RD_GREEN; ModelName: LED0603-RD_GREEN
LED3 = XL-1608UGC-04: 灯头类型:-;发光颜色:翠绿色;正向压降(Vf):3.3V;功率:70mW;正向电流:20mA;波长:515nm~535nm;二极管配置:独立二极管;透镜颜色:无色透明透镜;色温:-;发光强度:810mcd;发光角度:120°;载带方式:正贴;工作温度:-40℃~+85℃;; Manufacturer: XINGLIGHT(成兴光); AddInBom: yes; ModelId: 7761174b67d9475ab0dbce38062fb2f90819f05c4eef4c71ace90d822a990e87; ModelTransform: 63.7794,31.496,0,0,0,0,0,0,0; Illumination Color: 翠绿色; Voltage - Forward(Vf): 3.3V; Power(Watts): 70mW; Forward Current: 20mA; Peak Wavelength: 525nm; Diode Configuration: 独立二极管; Lens Color: 无色透明透镜; Luminous Intensity: 810mcd; Viewing Angle: 120°; Symbol: XL-1608UGC-04; Device: XL-1608UGC-04; LCSC Part Name: 0603翠绿贴片式发光二极管; SupplierPart: C965804; ManufacturerPart: XL-1608UGC-04; Supplier Footprint: 0603; JLCPCB Part Class: Extended Part; Datasheet: https://item.szlcsc.com/datasheet/XL-1608UGC-04/1051413.html; Supplier: LCSC; ConvertToPcb: yes; FootprintName: LED0603-RD_GREEN; ModelName: LED0603-RD_GREEN; Lamp Holder Type: -; Wavelength - Dominant: 515nm~535nm; Color Temperature: -; Mounting Style: 正贴; Operating Temperature: -40℃~+85℃
P1-P3 = WJ500V-5.08-2P: 结构:1x2P;间距:5.08mm;颜色:绿色;安装方式:直插;额定电流:18A;额定电压:250V;排数:1;线规 - AWG:14~30;线规 - 平方毫米:2.5;每排PIN数:2;触头材质:-;触头镀层:-;工作温度范围:-40℃~+105℃;焊接温度(最大值):-;; Manufacturer: KANGNEX(康奈克斯电气); Symbol: WJ500V-5.08-2P-14-00A; AddInBom: yes; ModelId: 0f4a503c8d3b4ae19ed61267f5e9a1d70819f05c4eef4c71ace90d822a990e87; ModelTransform: 423.621,393.7,0,0,0,0,-11.811,19.685,-137.795; Structure: 1x2P; Pitch: 5.08mm; Current Rating (Max): 18A; Voltage Rating (Max): 250V; Wire Gauge - AWG: 14~30; Wire Gauge - mm2: 2.5; Number of PINs Per Row: 2; Screw Specification: M2.5; Device: WJ500V-5.08-2P; LCSC Part Name: 1x2P 5.08mm 直插 排数:1 每排P数:2; SupplierPart: C8465; ManufacturerPart: WJ500V-5.08-2P; Supplier Footprint: 插件,P=5.08mm; JLCPCB Part Class: Extended Part; Datasheet: https://atta.szlcsc.com/upload/public/pdf/source/20191225/C8465_02D34CE5B5B4A53DF5891601D97FA9F4.pdf; Supplier: LCSC; ConvertToPcb: yes; FootprintName: CONN-TH_2P-P5.00_WJ500V-5.08-2P; ModelName: CONN-TH_2P-P5.00_WJ500V-5.08-2P; Color: 绿色; Mounting Style: 直插; Number of Pins: 2P; Number of Rows: 1; Contact Material: -; Contact Plating: -; Operating Temperature Range: -40℃~+105℃; Soldering Temperature(Max): -
Q1-Q4 = IRFP4468PBF: 类型:1个N沟道;漏源电压(Vdss):100V;连续漏极电流(Id):290A;导通电阻(RDS(on)@Vgs,Id):2.6mΩ@10V,180A;功率(Pd):520W;阈值电压(Vgs(th)@Id):4V@250uA;; Manufacturer: Infineon(英飞凌); Add into BOM: yes; 3D Model: 6e387369c9904836bdc1f26e11437a00; 3D Model Transform: 622.046,196.88937,0,0,0,0,0,-11.811,-137.795; Reverse Transfer Capacitance (Crss@Vds): 540pF; Type: 1个N沟道; Drain Source Voltage (Vdss): 100V; Continuous Drain Current (Id): 290A; Power Dissipation (Pd): 520W; Total Gate Charge (Qg@Vgs): 540nC; Input Capacitance (Ciss@Vds): 19.86nF; ModelName: TO-247AC-3_L15.8-W5.0-H20.5-P5.46; Symbol: IRFP4468PBF; Device: IRFP4468PBF; Convert to PCB: yes; LCSC Part Name: 1个N沟道 耐压:100V 电流:290A; Supplier Part: C2919; Manufacturer Part: IRFP4468PBF; Supplier Footprint: TO-247AC-3; JLCPCB Part Class: Extended Part; Datasheet: https://atta.szlcsc.com/upload/public/pdf/source/20200421/C513172_0206954A6A294F6A4994DAF9F319B5AC.pdf; Supplier: LCSC; Operating Temperature: -55℃~+175℃; Drain Source On Resistance (RDS(on)@Vgs,Id): 2.6mΩ@10V,180A; Gate Threshold Voltage (Vgs(th)@Id): 4V@250uA; FootprintName: TO-247AC-3_L15.8-W5.0-P5.46-L
R1 R3 R5 R22 R25-R27 R29 R30 R37 R38 = MFR0W4F3301A50: 电阻类型:金属膜电阻;阻值:3.3kΩ;精度:±1%;功率:250mW;温度系数:±50ppm/℃;; Manufacturer: UNI-ROYAL(厚声); AddInBom: yes; ModelId: 259c3103781c424fb695c8049f0a17f30819f05c4eef4c71ace90d822a990e87; ModelTransform: 437.007,91.18383,0,0,0,0,0,0,-137.795; Tolerance: ±1%; Voltage-Supply(Max): 250V; Power(Watts): 250mW; Symbol: MFR0W4F3301A50; Device: MFR0W4F3301A50; LCSC Part Name: 3.3kΩ ±1% 250mW 金属膜电阻 铜脚，圆柱状直插; SupplierPart: C58610; ManufacturerPart: MFR0W4F3301A50; Supplier Footprint: 插件,D2.2xL6.5mm; JLCPCB Part Class: Extended Part; Datasheet: https://atta.szlcsc.com/upload/public/pdf/source/20191012/C436293_8820AA14BC71FA35E551C06C441482A0.pdf; Supplier: LCSC; ConvertToPcb: yes; FootprintName: RES-TH_BD2.2-L6.5-P10.50-D0.6; ModelName: RES-TH_BD2.2-L6.5-P10.50-D0.6; Type: 金属膜电阻; Value: 3.3kΩ; Temperature Coefficient: ±50ppm/℃
R2 R6-R10 R14-R17 R20 R21 = MFR01SF1002A10: 电阻类型:金属膜电阻;阻值:10kΩ;精度:±1%;功率:1W;温度系数:±50ppm/℃;; Manufacturer: UNI-ROYAL(厚声); AddInBom: yes; ModelId: 8cdc597c9b3f496195c9a4ae737df7de0819f05c4eef4c71ace90d822a990e87; ModelName: RES-TH_BD4.5-L11.5-P15.50; ModelTransform: 633.857,177.952,0,0,0,0,0,0,-137.795; Tolerance: ±1%; Voltage-Supply(Max): 350V; Power(Watts): 1W; Symbol: MFR01SF1002A10; Device: MFR01SF1002A10; LCSC Part Name: 10kΩ ±1% 1W 金属膜电阻 小体积,铜脚，圆柱状直插; SupplierPart: C58714; ManufacturerPart: MFR01SF1002A10; Supplier Footprint: 插件,D3.5xL9.5mm; JLCPCB Part Class: Extended Part; Datasheet: https://item.szlcsc.com/datasheet/MFR01SF1002A10/59759.html; Supplier: LCSC; ConvertToPcb: yes; FootprintName: RES-TH_BD4.5-L11.5-P15.50-D0.7; Type: 金属膜电阻; Value: 10kΩ; Temperature Coefficient: ±50ppm/℃; Operating Temperature: -
R4 = 3296W-1-503LF_C49190466: 阻值:50kΩ;精度:±10%;功率:500mW;温度系数:±150ppm/℃;; Manufacturer: JIERR(捷而瑞); 3D Model: 3664f7b541aa4725a8b6d3b7a961f0780819f05c4eef4c71ace90d822a990e87; 3D Model Transform: 374.015,188.976,0,90,0,0,2.362,0.005,-137.795; Tolerance: ±10%; Power(Watts): 500mW; Number of Turns: 28; AddInBom: yes; Symbol: 3296W-1-503LF_C49190466; Device: 3296W-1-503LF_C49190466; LCSC Part Name: 玻璃釉预调电位器; Supplier Part: C49190466; Manufacturer Part: 3296W-1-503LF; Supplier Footprint: 插件-3P,9.5x4.9mm; JLCPCB Part Class: Extended Part; Datasheet: https://item.szlcsc.com/datasheet/3296W-1-503LF/51587059.html; Supplier: LCSC; Value: 50kΩ; Temperature Coefficient: ±150ppm/℃; ConvertToPcb: yes; FootprintName: RES-ADJ-TH_3296W; ModelName: RES-ADJ-TH_3296W
R11 = MFR01SF1002A10: 电阻类型:金属膜电阻;阻值:10kΩ;精度:±1%;功率:1W;温度系数:±50ppm/℃;; Manufacturer: UNI-ROYAL(厚声); 3D Model: 8cdc597c9b3f496195c9a4ae737df7de0819f05c4eef4c71ace90d822a990e87; 3D Model Transform: 633.857,177.952,0,0,0,0,0,0,-137.795; Tolerance: ±1%; Voltage-Supply(Max): 350V; Power(Watts): 1W; AddInBom: yes; ModelName: RES-TH_BD4.5-L11.5-P15.50; Symbol: MFR01SF1002A10; Device: MFR01SF1002A10; LCSC Part Name: 10kΩ ±1% 1W 金属膜电阻 小体积,铜脚，圆柱状直插; Supplier Part: C58714; Manufacturer Part: MFR01SF1002A10; Supplier Footprint: 插件,D3.5xL9.5mm; JLCPCB Part Class: Extended Part; Datasheet: https://item.szlcsc.com/datasheet/MFR01SF1002A10/59759.html; Supplier: LCSC; Type: 金属膜电阻; Value: 10kΩ; Temperature Coefficient: ±50ppm/℃; Operating Temperature: -; ConvertToPcb: yes; FootprintName: RES-TH_BD4.5-L11.5-P15.50-D0.7
R12 R13 = JER2512F3R001L: 电阻类型:采样电阻；合金电阻;阻值:1mΩ;精度:±1%;功率:3W;温度系数:±50ppm/℃;; Manufacturer: JIERR(捷而瑞); AddInBom: yes; ModelId: 954b67263d9e4f3582d8de3f8c8464210819f05c4eef4c71ace90d822a990e87; ModelName: R2512_L6.3-W3.2-H0.6; ModelTransform: 248.031,125.984,0,0,0,0,-0.0005,0,0; Tolerance: ±1%; Power(Watts): 3W; Symbol: JER2512F3R001L; Device: JER2512F3R001L; LCSC Part Name: 1mΩ 3W 2512 ±1%; SupplierPart: C46634444; ManufacturerPart: JER2512F3R001L; Supplier Footprint: 2512; JLCPCB Part Class: Extended Part; Datasheet: https://item.szlcsc.com/datasheet/JER2512F3R001L/48788246.html; Supplier: LCSC; ConvertToPcb: yes; FootprintName: R2512; Type: 采样电阻；合金电阻; Value: 1mΩ; Temperature Coefficient: ±50ppm/℃
R18 R19 R23 R24 = MOR02SJ0100A10: 电阻类型:金属氧化膜电阻;阻值:10Ω;精度:±5%;功率:2W;温度系数:±350ppm/℃;; Manufacturer: UNI-ROYAL(厚声); AddInBom: yes; ModelId: 8cdc597c9b3f496195c9a4ae737df7de0819f05c4eef4c71ace90d822a990e87; ModelName: RES-TH_BD4.5-L11.5-P15.50; ModelTransform: 633.857,177.952,0,0,0,0,0,0,-137.795; Tolerance: ±5%; Voltage-Supply(Max): 350V; Power(Watts): 2W; Symbol: MOR02SJ0100A10; Device: MOR02SJ0100A10; LCSC Part Name: 10Ω ±5% 2W 金属氧化膜电阻 小体积,金属氧化膜电阻 铜脚，圆柱状直插; SupplierPart: C61333; ManufacturerPart: MOR02SJ0100A10; Supplier Footprint: 插件,D4.5xL11.5mm; JLCPCB Part Class: Extended Part; Datasheet: https://item.szlcsc.com/datasheet/MOR02SJ0100A10/62386.html; Supplier: LCSC; ConvertToPcb: yes; FootprintName: RES-TH_BD4.5-L11.5-P15.50-D0.7; Type: 金属氧化膜电阻; Value: 10Ω; Temperature Coefficient: ±350ppm/℃
R28 = MF1/4W-4.7KΩ±1% T: 电阻类型:金属膜电阻;阻值:4.7kΩ;精度:±1%;功率:250mW;温度系数:±100ppm/℃;; Manufacturer: CCO(千志电子); Symbol: MF1/4W-4.7KΩ±1% T52; AddInBom: yes; ModelId: 8e6c7ee8323443d1ab8f0504b6353c8c0819f05c4eef4c71ace90d822a990e87; ModelName: RES-TH_D2.3-L6.5-P10.50; ModelTransform: 431.1015,91.3384,0,0,0,0,0.197,0,-137.795; Tolerance: ±1%; Voltage-Supply(Max): 250V; Power(Watts): 250mW; Device: MF1/4W-4.7KΩ±1% T; LCSC Part Name: 4.7kΩ ±1% 250mW 金属膜电阻 圆柱状直插; SupplierPart: C119339; ManufacturerPart: MF1/4W-4.7KΩ±1% T; Supplier Footprint: 插件,D2.3xL6.5mm; JLCPCB Part Class: Extended Part; Datasheet: https://item.szlcsc.com/datasheet/MF1%252F4W-4.7K%25CE%25A9%25C2%25B11%2525%2520T/120608.html; Supplier: LCSC; ConvertToPcb: yes; FootprintName: RES-TH_BD2.3-L6.5-P10.50-D0.5; Type: 金属膜电阻; Value: 4.7kΩ; Temperature Coefficient: ±100ppm/℃; Operating Temperature: -55℃~+155℃
R31 R33 R35 R36 = MF2WS-68KΩ±1% T: 电阻类型:金属膜电阻;阻值:68kΩ;精度:±1%;功率:2W;温度系数:±100ppm/℃;; Manufacturer: CCO(千志电子); AddInBom: yes; ModelId: 8cdc597c9b3f496195c9a4ae737df7de0819f05c4eef4c71ace90d822a990e87; ModelName: RES-TH_BD4.5-L11.5-P15.50; ModelTransform: 633.857,177.952,0,0,0,0,0,0,-137.795; Tolerance: ±1%; Voltage-Supply(Max): 350V; Power(Watts): 2W; Symbol: MF2WS-68KΩ±1% T; Device: MF2WS-68KΩ±1% T; LCSC Part Name: 68kΩ ±1% 2W 金属膜电阻; SupplierPart: C119629; ManufacturerPart: MF2WS-68KΩ±1% T; Supplier Footprint: 插件,D4.5xL11.5mm; JLCPCB Part Class: Extended Part; Datasheet: https://atta.szlcsc.com/upload/public/pdf/source/20190910/C427326_62A6D058BC0FF74963A2F22379CA06CE.pdf; Supplier: LCSC; ConvertToPcb: yes; FootprintName: RES-TH_BD4.5-L11.5-P15.50-D0.7; Type: 金属膜电阻; Value: 68kΩ; Temperature Coefficient: ±100ppm/℃; Operating Temperature: -55℃~+155℃
R32 R34 R41-R46 = MFR02SF1000A10: 电阻类型:金属膜电阻;阻值:100Ω;精度:±1%;功率:2W;温度系数:±50ppm/℃;; Manufacturer: UNI-ROYAL(厚声); AddInBom: yes; ModelId: fc5c109b76f247e2a5028dac0cfd05ca0819f05c4eef4c71ace90d822a990e87; ModelTransform: 795.27392,196.37071,0,0,0,0,0,0,-118.11; Tolerance: ±1%; Voltage-Supply(Max): 500V; Power(Watts): 2W; Symbol: MFR02SF1000A10; Device: MFR02SF1000A10; LCSC Part Name: 100Ω ±1% 2W 金属膜电阻 小体积,铜脚，圆柱状直插; SupplierPart: C58717; ManufacturerPart: MFR02SF1000A10; Supplier Footprint: 插件,D4xL11.5mm; JLCPCB Part Class: Extended Part; Datasheet: https://item.szlcsc.com/datasheet/MFR02SF1000A10/59762.html; Supplier: LCSC; ConvertToPcb: yes; FootprintName: RES-TH_BD5.0-L15.5-P19.50-D0.70; ModelName: RES-TH_BD5.0-L15.5-P19.50-D0.70; Type: 金属膜电阻; Value: 100Ω; Temperature Coefficient: ±50ppm/℃
R39 R40 R47 R48 = MFR0W4F1502A50: 电阻类型:金属膜电阻;阻值:15kΩ;精度:±1%;功率:250mW;温度系数:±50ppm/℃;; Manufacturer: UNI-ROYAL(厚声); AddInBom: yes; ModelId: 259c3103781c424fb695c8049f0a17f30819f05c4eef4c71ace90d822a990e87; ModelTransform: 437.007,91.18383,0,0,0,0,0,0,-137.795; Tolerance: ±1%; Voltage-Supply(Max): 250V; Power(Watts): 250mW; Symbol: MFR0W4F1502A50; Device: MFR0W4F1502A50; LCSC Part Name: 15kΩ ±1% 250mW 金属膜电阻 铜脚，圆柱状直插; SupplierPart: C58617; ManufacturerPart: MFR0W4F1502A50; Supplier Footprint: 插件,D2.2xL6.5mm; JLCPCB Part Class: Extended Part; Datasheet: https://atta.szlcsc.com/upload/public/pdf/source/20191012/C436293_8820AA14BC71FA35E551C06C441482A0.pdf; Supplier: LCSC; ConvertToPcb: yes; FootprintName: RES-TH_BD2.2-L6.5-P10.50-D0.6; ModelName: RES-TH_BD2.2-L6.5-P10.50-D0.6; Type: 金属膜电阻; Value: 15kΩ; Temperature Coefficient: ±50ppm/℃
SW1 SW2 = TS-1088-AR02016: 电路结构:单刀单掷;按钮形状:圆形按钮;作用力:1.6N;安装方式:立贴;开关长度:4mm;开关宽度:3mm;开关高度:2mm;带支架:不带支架;触点电流:50mA;额定电压:12V;工作寿命:10万次;; Manufacturer: XUNPU(讯普); 3D Model: b26698b69f274ffabef8a26c7d0e5dd10819f05c4eef4c71ace90d822a990e87; 3D Model Transform: 188.976,114.174,0,0,0,0,0,0,0; Circuit: 单刀单掷; Actuator Style: 圆形按钮; Operating Force: 1.6N; Switch Height: 2mm; with Bracket: 不带支架; Contact Current: 50mA; Voltage Rating: 12V; Actuator/Cap Color: 黑色; Life: 10万次; AddInBom: yes; ModelName: SW-SMD_L3.9-W2.9-H2.0-LS4.8; Symbol: TS-1088-AR02016; Device: TS-1088-AR02016; LCSC Part Name: 4*3*2mm 立贴 轻触开关; Supplier Part: C720477; Manufacturer Part: TS-1088-AR02016; Supplier Footprint: SMD,4x3mm; JLCPCB Part Class: Basic Part; Datasheet: https://item.szlcsc.com/datasheet/TS-1088-AR02016/763484.html; Supplier: LCSC; Mounting Type: 立贴; Length: 4mm; Width: 3mm; Termination Style: SMD接片; Operating Temperature: -30℃~+80℃; ConvertToPcb: yes; FootprintName: SW-SMD_L3.9-W3.0-P4.45
TP1-TP13 = Test-Point: Test Point 测试点; AddInBom: yes; Symbol: Test-Point; Device: Test-Point; ConvertToPcb: yes; FootprintName: Test-Point-0.5mm
U1-U3 = GS8552-SR: 放大器数:双路;增益带宽积(GBP):1.8MHz;输入偏置电流(Ib):20pA;输入失调电压(Vos):30uV;压摆率(SR):0.95V/us;轨到轨:轨到轨输入,轨到轨输出;; Manufacturer: Gainsil(聚洵); Relevance: []; 3D Model: e81d2f7d937b4a6ab1dca543ff5d56a40819f05c4eef4c71ace90d822a990e87; 3D Model Transform: 192.913,236.22,0,0,0,0,0,0,0; Number of Channels: 双路; Gain Bandwidth Product: 1.8MHz; Ib - Input Bias Current: 20pA; Vos - Input Offset Voltage: 30uV; Common Mode Rejection Ratio(CMRR): 110dB; Output Current: 65mA; Input Offset Voltage Drift(Vos TC): 10nV/℃; Quiescent Current(Iq): 180uA; Single Supply: 1.8V~5.5V; Dual Supply: 900mV~2.75V；-2.75V~-900mV; Maximum Power Supply Range (Vdd-Vss): 5.5V; Noise density(eN): 38nV/√Hz@1kHz; Input Offset Current(Ios): 10pA; AddInBom: yes; ModelName: SOIC-8_L4.9-W3.9-H1.7-LS6.0-P1.27; Symbol: GS8552-SR; Device: GS8552-SR; LCSC Part Name: 带射频滤波器的1.8MHz零漂移CMOS轨到轨输入输出运算放大器; Supplier Part: C157716; Manufacturer Part: GS8552-SR; Supplier Footprint: SOIC-8; JLCPCB Part Class: Extended Part; Datasheet: https://item.szlcsc.com/datasheet/GS8552-SR/169064.html; Supplier: LCSC; Slew Rate: 0.95V/us; Rail to Rail: 轨到轨输入,轨到轨输出; Operating Temperature: -40℃~+125℃; ConvertToPcb: yes; FootprintName: SOIC-8_L4.9-W3.9-P1.27-LS6.0-BL
U4-U7 U10 U17-U23 = CD1H106KC9IER2F100: 容值:10uF;精度:±10%;额定电压:50V;温度系数:X5R;; Manufacturer: Dersonic(德尔创); AddInBom: yes; ModelId: 30ed28be0b3b4d15a702e5d47761fb1d0819f05c4eef4c71ace90d822a990e87; ModelName: CAP-TH_L4.2-W3.8-H3.8-P5.08; ModelTransform: 215.7476,118.11,0,0,0,0,0,0,-137.795; Tolerance: ±10%; Voltage Rating: 50V; Temperature Coefficient: X5R; Pin Spacing: 5.08mm; Symbol: CD1H106KC9IER2F100; Device: CD1H106KC9IER2F100; LCSC Part Name: 10uF ±10% 50V; SupplierPart: C2761740; ManufacturerPart: CD1H106KC9IER2F100; Supplier Footprint: 插件,P=5.08mm; JLCPCB Part Class: Extended Part; Datasheet: https://item.szlcsc.com/datasheet/CD1H106KC9IER2F100/2886487.html; Supplier: LCSC; ConvertToPcb: yes; FootprintName: CAP-TH_L5.5-W3.8-P5.08-D0.5; Value: 10uF
U8 U9 = SI8233BD-D-IS: 驱动配置:低边；高边;负载类型:MOSFET;驱动通道数:2;灌电流(IOL):-;拉电流(IOH):-;工作电压:2.7V~5.5V;上升时间(tr):-;下降时间(tf):12ns;; Manufacturer: SKYWORKS/SILICON LABS(芯科); AddInBom: yes; ModelId: 2da8125c657e49328ba6fa7b098653dd0819f05c4eef4c71ace90d822a990e87; ModelName: SOIC-16_L10.3-W7.5-H2.7-LS10.3-P1.27; ModelTransform: 405.511,409.68154,0,0,0,0,-0.0005,0,0; Driven Configuration: 低边；高边; Load Type: MOSFET; Number of Drivers: 2; Fall Time: 12ns; Quiescent Current(Iq): 2mA; Symbol: SI8233BD-D-IS; Device: SI8233BD-D-IS; LCSC Part Name: SI8233BD-D-IS; SupplierPart: C430246; ManufacturerPart: SI8233BD-D-IS; Supplier Footprint: SOIC-16-300mil; JLCPCB Part Class: Extended Part; Datasheet: https://item.szlcsc.com/datasheet/SI8233BD-D-IS/425728.html; Supplier: LCSC; ConvertToPcb: yes; FootprintName: SOIC-16_L10.3-W7.5-P1.27-LS10.3-BL; Current - Output Low(IOL): -; Current - Output High(IOH): -; Voltage - Supply: 2.7V~5.5V; Rise Time: -; Propagation Delay tpLH: -; Propagation Delay tpHL: -; Features: 欠压保护(UVP); Operating Temperature: -40℃~+125℃; Input Logic Level - High: -; Input Logic Level - Low: -
U11 = HS96L03W2C03: 核心芯片:SSD1315芯片;接口类型:I2C;尺寸(inch):0.96;像素分辨率:128x64;; Manufacturer: HS(汉昇); 3D Model: bb65183306db4ca69fb52250be49b00e0819f05c4eef4c71ace90d822a990e87; 3D Model Transform: 1070.864,1094.486,0,0,0,0,0,-498.424,0; Interface: I2C; Dot Pixels: 128x64; Type of Drive: 无源(PMOLED); Display Range: 21.744x10.864mm; Display Color: 白色; Luminance: 180cd/m2; AddInBom: yes; Symbol: HS96L03W2C03; Device: HS96L03W2C03; LCSC Part Name: 0.96寸OLED显示屏窄白光IIC; Supplier Part: C5248080; Manufacturer Part: HS96L03W2C03; Supplier Footprint: -; JLCPCB Part Class: Extended Part; Datasheet: https://item.szlcsc.com/datasheet/HS96L03W2C03/5960631.html; Supplier: LCSC; Controller Type: SSD1315芯片; Size: 0.96; Operating Temperature: -40℃~+70℃; Function: -; Quiescent Current: -; ConvertToPcb: yes; FootprintName: OLED-TH_L27.8-W27.2-P2.54_C9900033791; ModelName: OLED-TH_L27.8-W27.2-P2.54_C9900033791
U12 = AMS1117-5.0_C6187: 输出类型:固定;工作电压:15V;输出电压:5V;输出电流:1A;电源纹波抑制比(PSRR):60dB;输出极性:正极;; Manufacturer: AMS; AddInBom: yes; ModelId: 925194bf9823436183a3e0b978a8d0760819f05c4eef4c71ace90d822a990e87; ModelName: SOT-223-4P_L6.5-W3.5-H1.6-LS7.0-P2.30; ModelTransform: 279.89794,255.905,0,180,0,0,0.0005,0.0005,0; Output Type: 固定; Voltage - Supply: 15V; Output Voltage: 5V; Output Current: 1A; Power Supply Rejection Ratio (PSRR): 60dB; Voltage Dropout: 1.3V; Output Configuration: 正极; Number of Outputs: 1; Symbol: AMS1117-5.0; Device: AMS1117-5.0_C6187; LCSC Part Name: 输入15V 输出5V 1A; SupplierPart: C6187; ManufacturerPart: AMS1117-5.0; Supplier Footprint: SOT-223; JLCPCB Part Class: Basic Part; Datasheet: https://item.szlcsc.com/datasheet/AMS1117-5.0/6653.html; Supplier: LCSC; ConvertToPcb: yes; FootprintName: SOT-223_L6.5-W3.5-P2.30-LS7.0-BR; standby current: -; Noise: -; Features: -; Operating Temperature: -40℃~+125℃
U13 = AMS1117-3.3_C6186: 输出类型:固定;工作电压:15V;输出电压:3.3V;输出电流:1A;电源纹波抑制比(PSRR):72dB@(120Hz);输出极性:正极;; Manufacturer: AMS; AddInBom: yes; ModelId: 925194bf9823436183a3e0b978a8d0760819f05c4eef4c71ace90d822a990e87; ModelName: SOT-223-4P_L6.5-W3.5-H1.6-LS7.0-P2.30; ModelTransform: 279.89794,255.905,0,180,0,0,-3.9385,-0.0005,0; Output Type: 固定; Voltage - Supply: 15V; Output Voltage: 3.3V; Output Current: 1A; Voltage Dropout: 1.1V@(800mA); standby current: 5mA; Noise: 0.003%Vout; Output Configuration: 正极; Number of Outputs: 1; Symbol: AMS1117-3.3; Device: AMS1117-3.3_C6186; LCSC Part Name: 3.3V 1A 15V; SupplierPart: C6186; ManufacturerPart: AMS1117-3.3; Supplier Footprint: SOT-223; JLCPCB Part Class: Basic Part; Datasheet: https://item.szlcsc.com/datasheet/AMS1117-3.3/6652.html; Supplier: LCSC; ConvertToPcb: yes; FootprintName: SOT-223-3_L6.5-W3.4-P2.30-LS7.0-BR; Power Supply Rejection Ratio (PSRR): 72dB@(120Hz); Features: 过流保护；热关断; Operating Temperature: -40℃~+125℃
U14 U15 = MFP-25BRD52-33K: 电阻类型:金属膜电阻;阻值:33kΩ;精度:±0.1%;功率:250mW;温度系数:±25ppm/℃;; Manufacturer: YAGEO(国巨); AddInBom: yes; ModelId: 463263665006444ab7a47bd11b0cf9560819f05c4eef4c71ace90d822a990e87; ModelTransform: 427.165,94.32816,0,0,0,0,0,0,-196.85; Tolerance: ±0.1%; Power(Watts): 250mW; Symbol: MFP-25BRD52-33K; Device: MFP-25BRD52-33K; LCSC Part Name: 金属膜电阻 33kΩ ±0.1% 250mW; SupplierPart: C1741268; ManufacturerPart: MFP-25BRD52-33K; Supplier Footprint: 插件,D2.4xL6.3mm; JLCPCB Part Class: Extended Part; Datasheet: https://item.szlcsc.com/datasheet/MFP-25BRD52-33K/1832049.html; Supplier: LCSC; ConvertToPcb: yes; FootprintName: RES-TH_BD2.4-L6.3-P10.30-D0.6; ModelName: RES-TH_BD2.4-L6.3-P10.30-D0.6; Type: 金属膜电阻; Value: 33kΩ; Temperature Coefficient: ±25ppm/℃; Operating Temperature: -55℃~+155℃
U16 = XL7005A: 功能类型:降压型;工作电压:5V~80V;输出电压:1.25V~20V;输出电流:400mA;输出类型:可调;; Manufacturer: XLSEMI(芯龙); AddInBom: yes; ModelId: 2424bcfd05224efdb78db06799097c7b0819f05c4eef4c71ace90d822a990e87; ModelTransform: 192.913,236.22,0,0,0,0,0,0,0; Function: 降压型; Voltage - Supply: 5V~80V; Output Current: 400mA; Frequency - Switching: 150kHz; Synchronous Rectifier: 否; Number of Outputs: 1; Topology: 降压式; Quiescent Current: 2.5mA; Switch tube (built-in/external): 内置; Output Type: 可调; Symbol: XL7005A; Device: XL7005A; LCSC Part Name: 0.4A 150kHz 80V 降压型DC-DC转换器; SupplierPart: C50848; ManufacturerPart: XL7005A; Supplier Footprint: SOIC-8-EP; JLCPCB Part Class: Extended Part; Datasheet: https://item.szlcsc.com/datasheet/XL7005A/51859.html; Supplier: LCSC; ConvertToPcb: yes; FootprintName: SOIC-8_L4.9-W3.9-P1.27-LS6.0-BL-EP3.1-1; ModelName: SOIC-8_L4.9-W3.9-P1.27-LS6.0-BL-EP3.1-1; Output Voltage: 1.25V~20V; Operating Temperature: -40℃~+125℃@(TJ)
U24 = LCKFB-DKX-STM32F103C8T6: 搭载Contex M3内核,程序存储容量64KB,RAM总容量20KB,最高72MHz主频,提供高效的计算能力和稳定的运行环境。; Manufacturer: 立创开发板; AddInBom: yes; ModelId: 70cdd142a616427fa7f75b03dcb285590819f05c4eef4c71ace90d822a990e87; ModelTransform: 2310.042,898.9982,0,0,0,0,90.551,0,-236.22; Symbol: LCKFB-DKX-STM32F103C8T6; Device: LCKFB-DKX-STM32F103C8T6; LCSC Part Name: 立创·地阔星-STM32F103C8T6开发板; SupplierPart: C22396880; ManufacturerPart: LCKFB-DKX-STM32F103C8T6; Supplier Footprint: -; JLCPCB Part Class: Extended Part; Datasheet: https://item.szlcsc.com/datasheet/LCKFB-DKX-STM32F103C8T6/24005615.html; Supplier: LCSC; ConvertToPcb: yes; FootprintName: CONN-TH_L53.3-W22.9_STM32F103C8T6-CARD; ModelName: CONN-TH_L53.3-W22.9_STM32F103C8T6-CARD